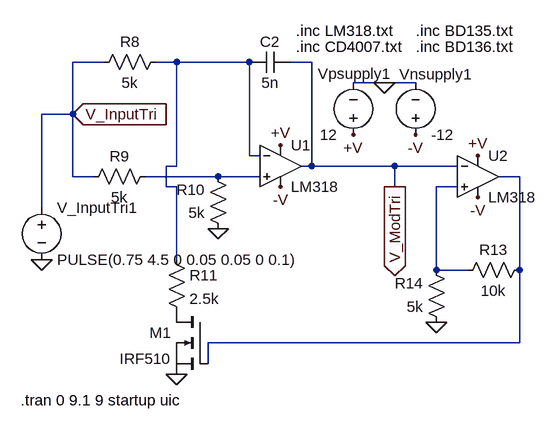
[diagram p0: schematic VCO_onlyORIGINAL.asc]
VCO_onlyORIGINAL.asc, the LTspice schematic file:
Version 4
SHEET 1 880 888
WIRE -528 352 -576 352
WIRE -416 352 -448 352
WIRE -304 352 -416 352
WIRE -208 352 -240 352
WIRE -96 384 -144 384
WIRE -48 384 -96 384
WIRE -576 432 -576 352
WIRE -576 432 -624 432
WIRE -304 496 -304 352
WIRE -288 496 -304 496
WIRE -416 512 -416 352
WIRE -416 512 -432 512
WIRE -208 512 -208 352
WIRE -208 512 -224 512
WIRE -80 512 -208 512
WIRE 16 512 -80 512
WIRE -576 528 -576 432
WIRE -544 528 -576 528
WIRE -352 528 -464 528
WIRE -288 528 -352 528
WIRE 112 528 80 528
WIRE -432 544 -432 512
WIRE -416 544 -432 544
WIRE -80 544 -80 512
WIRE 16 544 -16 544
WIRE -624 576 -624 432
WIRE -416 656 -416 544
WIRE -16 672 -16 544
WIRE 32 672 -16 672
WIRE 112 672 112 528
WIRE 112 784 112 672
WIRE 112 784 -368 784
WIRE -368 816 -368 784
FLAG -96 384 0
FLAG -144 464 +V
FLAG -48 464 -V
FLAG -352 608 0
FLAG -416 832 0
FLAG -16 752 0
FLAG -624 656 0
FLAG -256 480 +V
FLAG 48 496 +V
FLAG -256 544 -V
FLAG 48 560 -V
FLAG -80 544 V_ModTri
IOPIN -80 544 Out
FLAG -576 432 V_InputTri
IOPIN -576 432 In
SYMBOL voltage -48 480 M180
WINDOW 0 -25 109 Left 2
WINDOW 3 24 16 Left 2
WINDOW 123 0 0 Left 2
WINDOW 39 0 0 Left 2
SYMATTR InstName Vnsupply1
SYMATTR Value -12
SYMBOL voltage -144 480 R180
WINDOW 0 -58 110 Left 2
WINDOW 3 24 16 Left 2
WINDOW 123 0 0 Left 2
WINDOW 39 0 0 Left 2
SYMATTR InstName Vpsupply1
SYMATTR Value 12
SYMBOL res -432 336 R90
WINDOW 0 0 56 VBottom 2
WINDOW 3 32 56 VTop 2
SYMATTR InstName R8
SYMATTR Value 5k
SYMBOL cap -240 336 R90
WINDOW 0 0 32 VBottom 2
WINDOW 3 32 32 VTop 2
SYMATTR InstName C2
SYMATTR Value 5n
SYMBOL res -448 512 R90
WINDOW 0 0 56 VBottom 2
WINDOW 3 32 56 VTop 2
SYMATTR InstName R9
SYMATTR Value 5k
SYMBOL res -336 624 R180
WINDOW 0 36 76 Left 2
WINDOW 3 36 40 Left 2
SYMATTR InstName R10
SYMATTR Value 5k
SYMBOL res -432 640 R0
SYMATTR InstName R11
SYMATTR Value 2.5k
SYMBOL res 128 656 R90
WINDOW 0 0 56 VBottom 2
WINDOW 3 32 56 VTop 2
SYMATTR InstName R13
SYMATTR Value 10k
SYMBOL res 0 768 R180
WINDOW 0 36 76 Left 2
WINDOW 3 36 40 Left 2
SYMATTR InstName R14
SYMATTR Value 5k
SYMBOL voltage -624 560 R0
WINDOW 123 0 0 Left 2
WINDOW 39 0 0 Left 2
SYMATTR InstName V_InputTri1
SYMATTR Value PULSE(0.75 4.5 0 0.05 0.05 0 0.1)
SYMBOL Opamps\\opamp2 -256 448 R0
SYMATTR InstName U1
SYMATTR Value LM318
SYMBOL Opamps\\opamp2 48 464 R0
SYMATTR InstName U2
SYMATTR Value LM318
SYMBOL nmos -368 736 M0
SYMATTR InstName M1
SYMATTR Value IRF510
TEXT -232 304 Left 2 !.inc LM318.txt
TEXT -48 304 Left 2 !.inc BD135.txt
TEXT -48 328 Left 2 !.inc BD136.txt
TEXT -232 328 Left 2 !.inc CD4007.txt
TEXT -656 872 Left 2 !.tran 0 9.1 9 startup uic

The netlist it stands for:
* VCO_onlyORIGINAL.asc
Vnsupply1 -V 0 -12
Vpsupply1 +V 0 12
R8 N001 V_InputTri 5k
C2 V_ModTri N001 5n
R9 N002 V_InputTri 5k
R10 0 N002 5k
R11 N001 P001 2.5k
R13 N003 N004 10k
R14 0 N004 5k
V_InputTri1 V_InputTri 0 PULSE(0.75 4.5 0 0.05 0.05 0 0.1)
XU1 N002 N001 +V -V V_ModTri LM318  ; pins In+ In- V+ V- OUT
XU2 N004 V_ModTri +V -V N003 LM318  ; pins In+ In- V+ V- OUT
M1 P001 N003 0 0 IRF510
.model NMOS NMOS
.model PMOS PMOS
.lib standard.mos
.inc LM318.txt
.inc BD135.txt
.inc BD136.txt
.inc CD4007.txt
.tran 0 9.1 9 startup uic
.backanno
.end